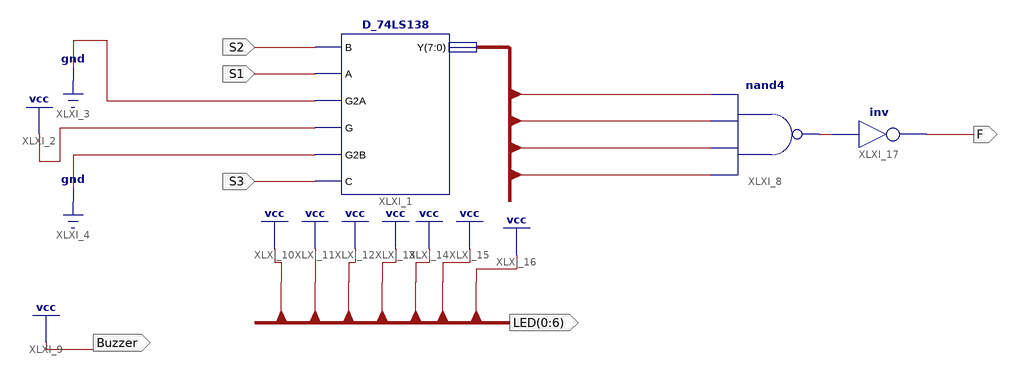
[diagram p0: schematic sheet 1]
// Xilinx ISE schematic LampCtrl138.sch (kintex7) as structural Verilog: 3 symbols, 6 ports
module LampCtrl138 (
  input  S1,
  input  S2,
  input  S3,
  output Buzzer,
  output [0:6] LED,
  output F
);

  wire XLXN_16;
  wire [7:0] y;

  D_74LS138 XLXI_1 (.B(S2), .A(S1), .G2A(1'b0), .G(1'b1), .G2B(1'b0), .C(S3), .Y(y));
  nand XLXI_8 (XLXN_16, y[7], y[4], y[2], y[1]);
  not XLXI_17 (F, XLXN_16);

  assign Buzzer = 1'b1;
  assign LED = {7{1'b1}};
endmodule
